# EasyEDA Pro project ProProject_Acho.epro, board PCB10
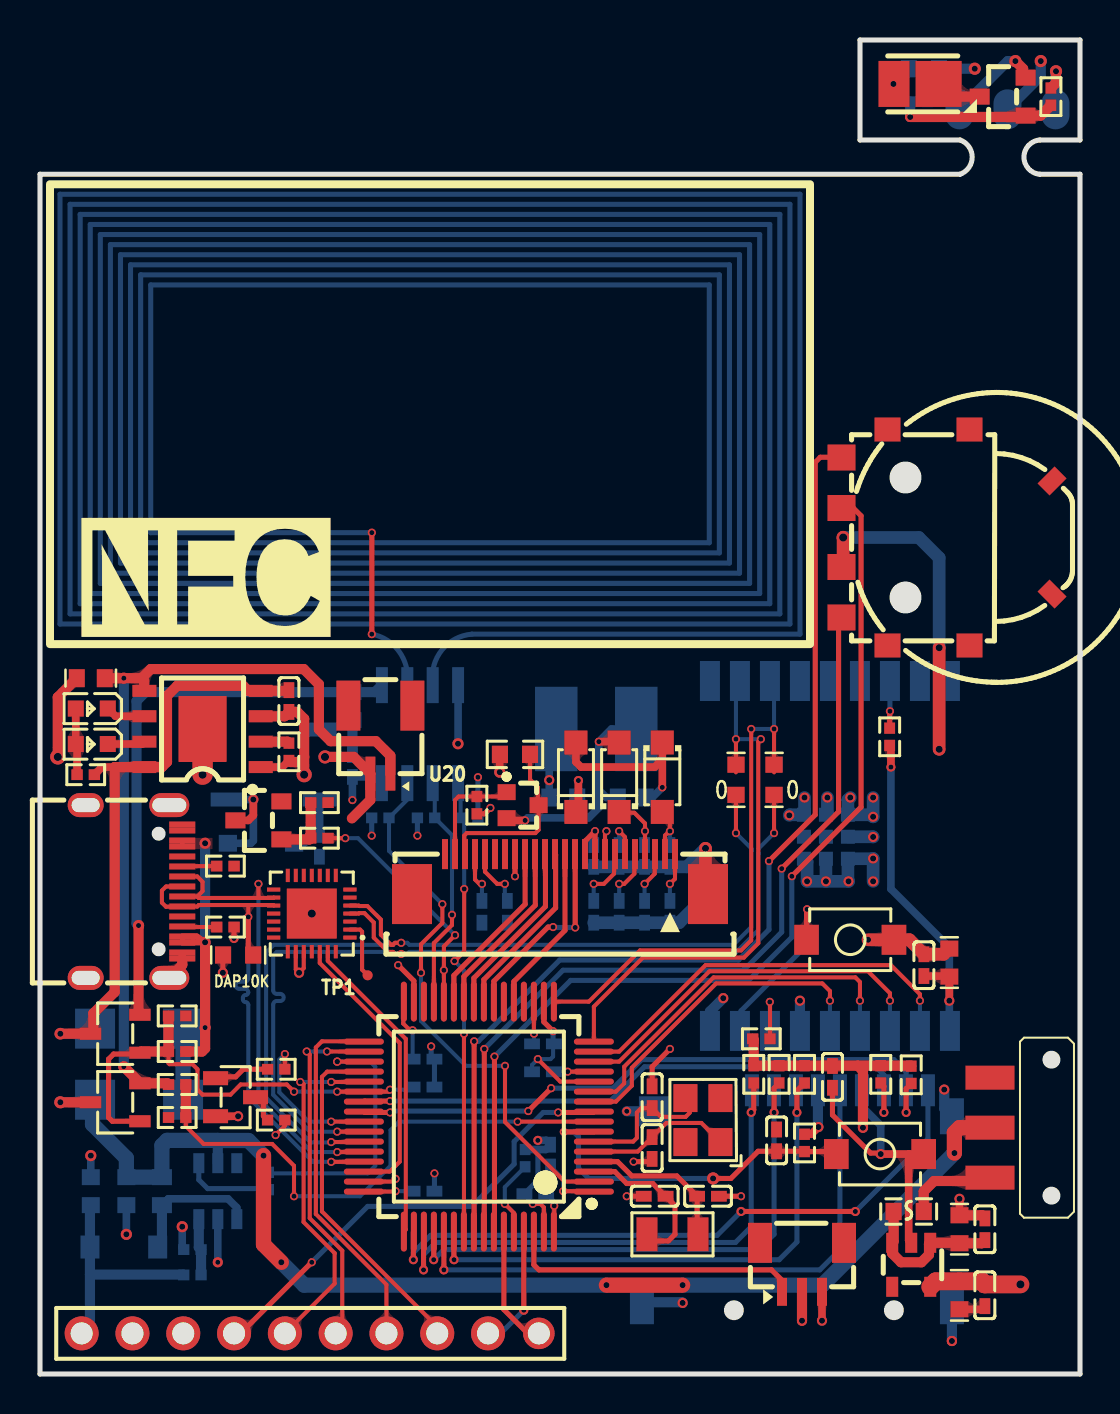
[diagram p0: board, top side]
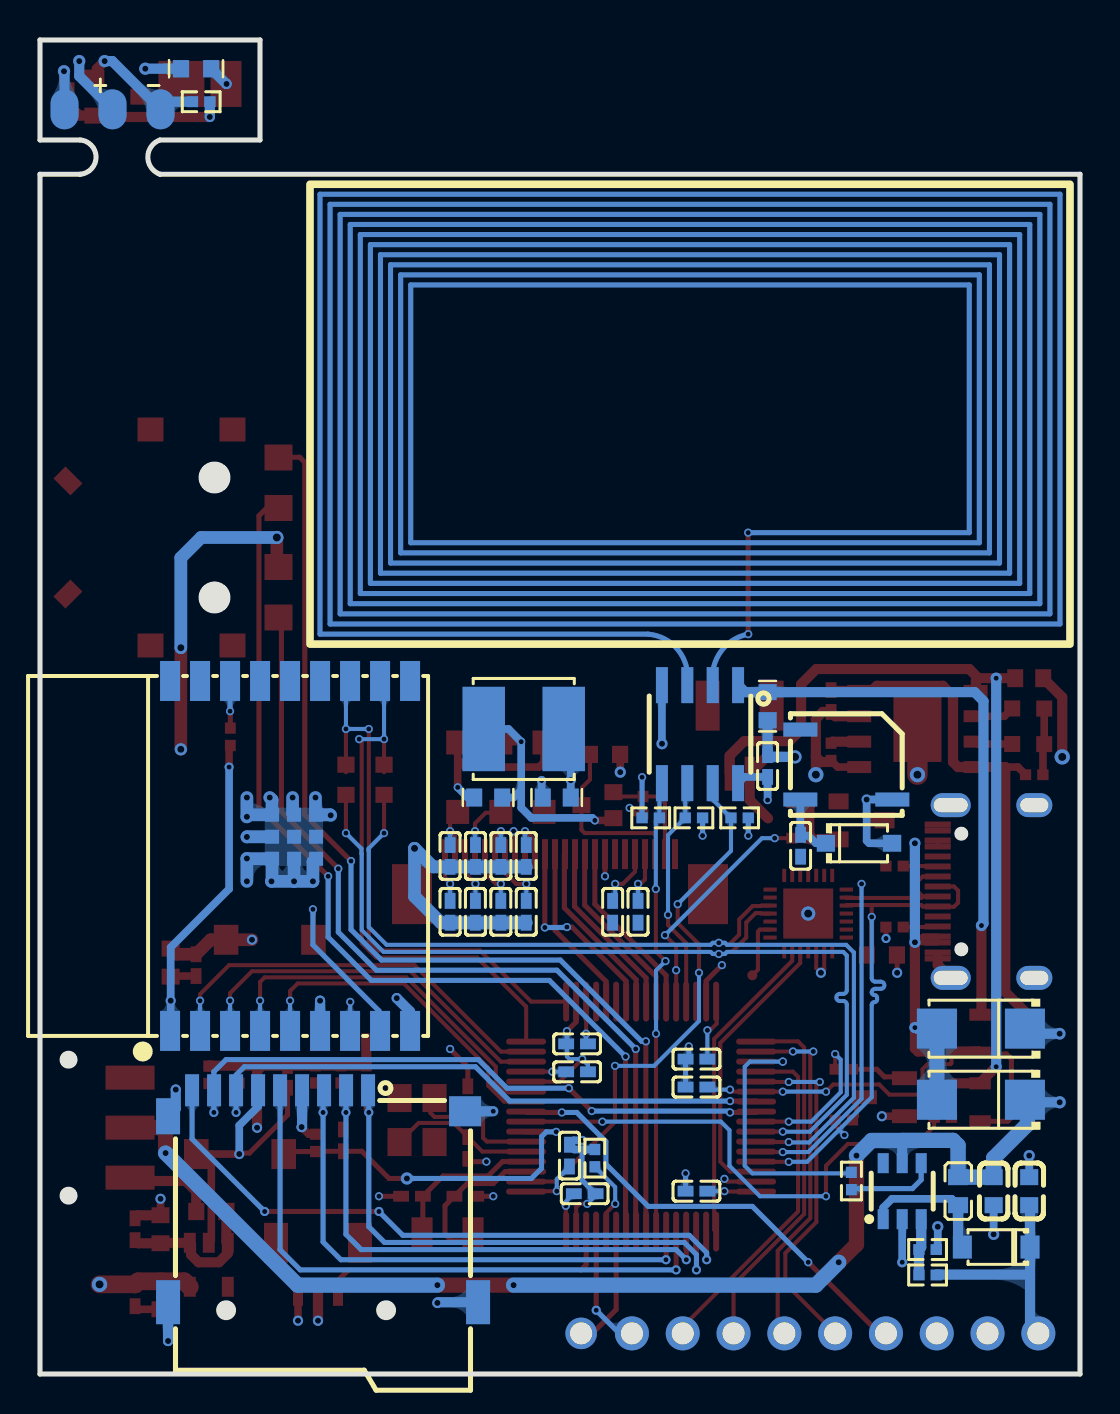
[diagram p1: board, bottom side, seen from below]

Outline 52 x 66.71 mm; copper layers: Top Layer, Inner1, Inner2, Bottom Layer. Coordinates in mm from the lower left corner of the outline.
Outline path: 0,60 0,0 52,0 52,60 50,60 arc(49.2,60.86) 50,61.71 52,61.71 52,66.71 41,66.71 41,61.71 46,61.71 arc(46.61,60.86) 46,60 0,60
Stack: Top Layer 0.035mm 外层铜厚1oz / Dielectric1 0.2104mm 7628 RC49% 8.6mil / Inner1 0.0152mm 内层铜厚 / Dielectric2 1.065mm 1.1mm H/HOZ 含铜 / Inner2 0.0152mm 内层铜厚 / Dielectric3 0.2104mm 7628 RC49% 8.6mil / Bottom Layer 0.035mm 外层铜厚1oz

## Design rules (mm)
net DAP_UART_TX: DP2
net DAP_UART_RX: DP2
net WIFI_UART_TX: DP1
net WIFI_UART_RX: DP1
template: 自定义配置
spacing copperThickness1oz (default): track to track 0.102, other pairs 0.152 to 0.3
spacing copperThickness2oz: track to track 0.203, other pairs 0.152 to 0.3
spacing copperThicknessInner0.5oz: track to track 0.089, other pairs 0.152 to 0.3
track width copperThickness1oz (default): min 0.102, default 0.254, max 2.54
track width copperThickness2oz: min 0.203, default 0.254, max 2.54
track width copperThickness0.5oz: min 0.089, default 0.254, max 2.54
differential pair differentialPair (default): width min 0.127, default 0.254, max 2.54; gap min 0.152, default 0.152
via viaSize (default): diameter min 0.3, default 0.5, max 10; hole min 0.2, default 0.26, max 6.3

## Placement (name value [footprint] x y rotation side)
BUZZER1  4000Hz  [BUZ-SMD_L5.0-W5.5-P4.60]  11.68 30.48 180 bottom
C1  100nF  [C0402]  25.53 10.92 270 bottom
C2  12pF  [C0402]  33.4 8.89 180 top
C3  12pF  [C0402]  30.73 8.89 0 top
C4  10pF  [C0402]  30.61 13.84 90 top
C5  100nF  [C0402]  36.83 11.68 270 top
C6  100nF  [C0402]  15.62 30.41 270 bottom
C7  20pF  [C0402]  30.61 11.3 270 top
C8  10uF  [C0603]  15.62 33.4 90 bottom
C9  100nF  [C0402]  19.18 14.35 180 bottom
C10  100nF  [C0402]  25.15 15.11 0 bottom
C11  100nF  [C0402]  25.15 16.51 180 bottom
C12  100nF  [C0402]  19.18 15.75 180 bottom
C13  100nF  [C0402]  19.18 9.14 180 bottom
C14  100nF  [C0402]  24.76 9.02 0 bottom
C15  1uF  [C0402]  22.1 23.11 90 bottom
C16  1uF  [C0402]  23.37 23.11 90 bottom
C17  100nF  [C0402]  12.45 33.66 90 top
C18  10uF  [C0603]  2.54 34.8 0 top
C19  100nF  [C0402]  39.62 14.86 90 top
C20  4.7uF  [C0603]  26.16 28.83 180 bottom
C21  100nF  [C0402]  27.69 25.91 90 bottom
C22  4.7uF  [C0603]  29.59 28.83 180 bottom
C23  1uF  [C0402]  27.69 23.11 90 bottom
C24  -  [C0402]  28.96 25.91 90 bottom
C25  -  [C0402]  28.96 23.11 90 bottom
C26  10uF  [C0603]  45.97 7.24 270 top
C27  100nF  [C0402]  47.24 7.24 270 top
C28  100nF  [C0402]  47.24 3.94 90 top
C29  10uF  [C0603]  45.97 3.94 90 top
C30  -  [C0402]  30.23 25.91 90 bottom
C31  -  [C0402]  30.23 23.11 90 bottom
C32  -  [C0402]  31.5 25.91 90 bottom
C33  -  [C0402]  31.5 23.11 90 bottom
C34  22uf  [C0603]  4.32 9.14 270 bottom
C35  100nF  [C0402]  44.2 20.45 270 top
C36  22uf  [C0603]  2.54 9.14 270 bottom
C37  10uF  [C0603]  45.47 20.57 270 top
C38  100nF  [C0402]  13.97 26.42 270 bottom
D1  SS34-A  [SMA_L4.3-W2.6-LS5.2-RD]  4.95 17.27 0 bottom
D2  SS34-A  [SMA_L4.3-W2.6-LS5.2-RD]  4.95 13.72 0 bottom
D3  MBR0530  [SOD-123FL_L2.7-W1.8-LS3.7-RD]  26.8 29.84 90 top
D4  MBR0530  [SOD-123FL_L2.7-W1.8-LS3.7-RD]  31.12 29.84 270 top
D5  MBR0530  [SOD-123FL_L2.7-W1.8-LS3.7-RD]  28.96 29.84 90 top
D6  DSS14  [SOD-123_L2.8-W1.8-LS3.7-RD]  4.19 6.35 0 bottom
L1  68uH  [IND-SMD_L5.0-W5.0]  27.81 32.26 180 bottom
L2  4.7uH-INDUCTOR-0603  [IND-SMD_L1.6-W1.0]  6.1 9.14 270 bottom
LED1  2835LEDLM281BA+,3000K,Ra90,S3亮度,VF=2.9-3.0V黄光  [LED-SMD_L3.5-W2.8_28353V60MA6500K]  43.81 64.52 0 top
LED2  -  [LED_0603]  2.54 33.27 180 top
LED3  -  [LED_0603]  2.54 31.5 180 top
Q1  S8550  [SOT-23-3_L2.9-W1.3-P1.90-LS2.4-BR]  9.78 13.84 180 top
Q2  -  [S8050_SOT-23]  48.13 63.75 0 top
Q3  SI1308EDL-T1-GE3  [SOT-323_L2.0-W1.3-P1.30-LS2.1-BR]  24.13 28.45 180 top
Q4  -  [S8050_SOT-23]  10.92 27.56 0 top
R1  10K  [R0402]  24.26 10.79 90 bottom
R2  10K  [R0402]  38.23 11.56 90 top
R3  10K  [R0402]  17.02 27.81 180 bottom
R4  2K  [R0402]  19.3 27.81 180 bottom
R5  2K  [R0402]  21.46 27.81 0 bottom
R6  10K  [R0402]  11.81 15.24 0 top
R7  10K  [R0402]  11.81 12.7 180 top
R8  -  [R0402]  9.27 22.35 0 top
R9  -  [R0402]  9.27 25.4 0 top
R10  2K  [R0402]  50.55 63.88 90 top
R11  10K  [R0603]  9.91 20.95 0 top
R13  10K  [R0402]  2.29 29.97 0 top
R14  0  [R0603]  36.7 29.72 270 top
R15  0  [R0603]  34.8 29.72 270 top
R16  1.2K  [R0402]  12.45 31.11 90 top
R17  3R  [R0603]  23.75 30.99 180 top
R18  10K  [R0402]  43.56 14.96 90 top
R19  10K  [R0402]  42.04 14.99 90 top
R20  10K  [R0402]  38.23 14.99 90 top
R21  10K  [R0402]  36.96 14.99 90 top
R22  10K  [R0402]  35.69 14.99 90 top
R23  10K  [R0402]  21.84 28.45 90 top
R24  -  [R0402]  6.86 16.13 180 top
R25  -  [R0402]  6.86 17.91 180 top
R26  -  [R0402]  6.86 14.48 180 top
R27  -  [R0402]  6.86 12.83 0 top
R28  10K  [R0402]  42.48 31.87 270 top
R29  10K  [R0402]  11.43 9.65 90 bottom
R30  10K  [R0402]  36.07 16.76 180 top
R31  -  [R0402]  7.62 4.95 0 bottom
R32  10K  [R0402]  7.62 6.22 0 bottom
R33  20R  [R0603]  44.2 65.28 0 bottom
R34  5.1K  [R0402]  43.94 63.63 180 bottom
R35  6.5K  [R0402]  13.97 26.8 180 top
R36  2K  [R0402]  13.97 28.58 180 top
SW1  -  [拨动开关封装]  47.5 12.32 270 top
TP1  -  [Test-Point-0.5mm]  16.38 19.94 0 top
U1  STM32F446RET6  [LQFP-64_L10.0-W10.0-P0.50-LS12.0-BL]  21.94 12.87 90 top
U2  二脚小龟直  [KEY-SMD_L3.9-W3.0-LS5.0]  42 11 0 top
U3  13.56MHz  [SO-8_L4.9-W3.9-P1.27-LS6.0-BL]  19 32 0 bottom
U4  CH549F  [QFN-28_L4.0-W4.0-P0.40-BL-EP]  13.59 23.03 90 top
U5  BX-SH1.0-3PLT  [CONN-SMD_3P-P1.00_BX-SH1.0-3PLT]  38.1 5.33 0 top
U6  -  [LED2835驱动板接口封装]  45.97 63.25 0 top
U7  TP4056  [ESOP-8_L4.9-W3.9-P1.27-LS6.0-BL-EP]  8.13 32.26 90 top
U8  PPFPC24/0.5mmSMD下面接触  [FPC-SMD_F0501-T-24-20T-R]  26 25 0 top
U9  SIQ-02FVS3  [SW-SMD_SIQ-02FVS3_1]  45.34 41.83 270 top
U10  自弹TF卡座TFAA  [SIM-SMD_C9900015645]  37.85 8.89 180 bottom
U11  AO3401  [SOT-23-3_L2.9-W1.6-P1.90-LS2.8-BR]  3.76 17.02 0 top
U12  AO3401  [SOT-23-3_L2.9-W1.6-P1.90-LS2.8-BR]  3.76 13.59 0 top
U13  FUSE0603  [F0603]  43.43 8.13 180 top
U14  RT9013-33GB  [SOT-23-5_L2.9-W1.6-P0.95-LS2.8-BR]  43.56 5.46 90 top
U15  -  [Acho音频模块接口封装]  8.31 1.27 0 top
U16  2.4GHz  [BULETM-SMD_ESPRESSIF_ESP32-C3-WROOM-02-N4-4MB]  39.5 25.91 90 bottom
U17  SX1308  [SOT-23-6_L2.9-W1.6-P0.95-LS2.8-BR]  8.89 9.14 270 bottom
U18  二脚小龟直  [KEY-SMD_L3.9-W3.0-LS5.0]  40.51 21.72 180 top
U19  1N4148  [SOD-123_L2.7-W1.7-LS3.8-RD]  11.05 26.54 180 bottom
U20  BX-SH1.0-2PWT  [CONN-SMD_2P-P1.00_BX-SH1.0-2PWT]  17.02 31.72 180 top
USB1  KH-TYPE-C-16P  [USB-C-SMD_KH-TYPE-C-16P]  4.7 24.13 270 top
X1  32.768kHz  [OSC-SMD_L3.2-W1.5]  31.62 6.99 0 top
X2  12MHz  [OSC-SMD_4P-L3.2-W2.5-BL]  33.15 12.7 90 top

## Footprints (pads in the part's own frame, mm; a bottom-side part is the same pattern mirrored in y, then rotated)
Acho音频模块接口封装
  round 1.575 hole 1.1: 1(16.637,0.762)
  round 1.7 hole 1.1: 2(14.097,0.762) 3(11.557,0.762) 4(9.017,0.762) 5(6.477,0.762) 6(3.937,0.762) 7(1.397,0.762) 8(-1.143,0.762) 9(-3.683,0.762) 10(-6.223,0.762)
BULETM-SMD_ESPRESSIF_ESP32-C3-WROOM-02-N4-4MB
  rect 2x1 smd: 1(-8.75,6) 2(-8.75,4.5) 3(-8.75,3) 4(-8.75,1.5) 5(-8.75,0) 6(-8.75,-1.5) 7(-8.75,-3) 8(-8.75,-4.5) 9(-8.75,-6) 10(8.75,-6) 11(8.75,-4.5) 12(8.75,-3) 13(8.75,-1.5) 14(8.75,0) 15(8.75,1.5) 16(8.75,3) 17(8.75,4.5) 18(8.75,6)
  rect 0.7x0.7 smd: 19(-0.14,-1.3) 19(-0.14,-0.2) 19(-0.14,0.9) 19(0.96,-1.3) 19(0.96,-0.2) 19(0.96,0.9) 19(2.06,-1.3) 19(2.06,-0.2) 19(2.06,0.9)
BUZ-SMD_L5.0-W5.5-P4.60
  rect 1.7x0.7 smd: 1(-2.3,-1.75) 2(2.3,-1.75) 3(-2.3,1.75)
C0402
  rect 0.79x0.54 smd: 1(-0.545,0) 2(0.545,0)
C0603
  rect 0.8x0.9 smd: 1(-0.7,0) 2(0.7,0)
CONN-SMD_2P-P1.00_BX-SH1.0-2PWT
  rect 0.5x1.7 smd: 1(-0.5,1.7) 2(0.5,1.7)
  rect 1.2x2.5 smd: 3(1.6,-1.7) 4(-1.6,-1.7)
CONN-SMD_3P-P1.00_BX-SH1.0-3PLT
  rect 0.5x1.4 smd: 1(-1,-1.225) 2(0,-1.225) 3(1,-1.225)
  rect 1.2x2 smd: 4(2.1,1.225) 5(-2.1,1.225)
ESOP-8_L4.9-W3.9-P1.27-LS6.0-BL-EP
  rect 0.6x1.2 smd: 1(-1.905,-2.909) 2(-0.635,-2.909) 3(0.635,-2.909) 4(1.905,-2.909) 5(1.905,2.909) 6(0.635,2.909) 7(-0.635,2.909) 8(-1.905,2.909)
  rect 3.3x2.4 smd: 9(0,0)
F0603
  rect 0.806x0.864 smd: 1(-0.753,0) 2(0.753,0)
FPC-SMD_F0501-T-24-20T-R
  rect 0.3x1.5 smd: 1(5.75,1) 2(5.25,1) 3(4.75,1) 4(4.25,1) 5(3.75,1) 6(3.25,1) 7(2.75,1) 8(2.25,1) 9(1.75,1) 10(1.25,1) 11(0.75,1) 12(0.25,1) 13(-0.25,1) 14(-0.75,1) 15(-1.25,1) 16(-1.75,1) 17(-2.25,1) 18(-2.75,1) 19(-3.25,1) 20(-3.75,1) 21(-4.25,1) 22(-4.75,1) 23(-5.25,1) 24(-5.75,1)
  rect 2x3 smd: 25(-7.4,-1) 26(7.4,-1)
IND-SMD_L1.6-W1.0
  rect 0.8x1 smd: 1(-0.7,0) 2(0.7,0)
IND-SMD_L5.0-W5.0
  rect 2.124x4.22 smd: 1(2,0) 2(-2,0)
KEY-SMD_L3.9-W3.0-LS5.0
  rect 1.23x1.5 smd: 1(-2.185,0) 2(2.185,0)
LED2835驱动板接口封装
  oval 1.4x2 smd far side: 1(4.8,0) 2(2.4,0) 3(0,0)
LED-SMD_L3.5-W2.8_28353V60MA6500K
  rect 1.55x2.3 smd: 1(-1.115,0)
  rect 2.3x2.3 smd: 2(1.115,0)
LED_0603
  rect 0.8x0.8 smd: 1(-0.851,-0.01) 2(0.75,-0.005)
LQFP-64_L10.0-W10.0-P0.50-LS12.0-BL
  oval 0.3x2 smd: 1(-3.75,-5.75) 2(-3.25,-5.75) 3(-2.75,-5.75) 4(-2.25,-5.75) 5(-1.75,-5.75) 6(-1.25,-5.75) 7(-0.75,-5.75) 8(-0.25,-5.75) 9(0.25,-5.75) 10(0.75,-5.75) 11(1.25,-5.75) 12(1.75,-5.75) 13(2.25,-5.75) 14(2.75,-5.75) 15(3.25,-5.75) 16(3.75,-5.75) 33(3.75,5.75) 34(3.25,5.75) 35(2.75,5.75) 36(2.25,5.75) 37(1.75,5.75) 38(1.25,5.75) 39(0.75,5.75) 40(0.25,5.75) 41(-0.25,5.75) 42(-0.75,5.75) 43(-1.25,5.75) 44(-1.75,5.75) 45(-2.25,5.75) 46(-2.75,5.75) 47(-3.25,5.75) 48(-3.75,5.75)
  oval 2x0.3 smd: 17(5.75,-3.75) 18(5.75,-3.25) 19(5.75,-2.75) 20(5.75,-2.25) 21(5.75,-1.75) 22(5.75,-1.25) 23(5.75,-0.75) 24(5.75,-0.25) 25(5.75,0.25) 26(5.75,0.75) 27(5.75,1.25) 28(5.75,1.75) 29(5.75,2.25) 30(5.75,2.75) 31(5.75,3.25) 32(5.75,3.75) 49(-5.75,3.75) 50(-5.75,3.25) 51(-5.75,2.75) 52(-5.75,2.25) 53(-5.75,1.75) 54(-5.75,1.25) 55(-5.75,0.75) 56(-5.75,0.25) 57(-5.75,-0.25) 58(-5.75,-0.75) 59(-5.75,-1.25) 60(-5.75,-1.75) 61(-5.75,-2.25) 62(-5.75,-2.75) 63(-5.75,-3.25) 64(-5.75,-3.75)
OSC-SMD_4P-L3.2-W2.5-BL
  rect 1.4x1.2 smd: 1(-1.1,-0.875) 2(1.1,-0.875) 3(1.1,0.875) 4(-1.1,0.875)
OSC-SMD_L3.2-W1.5
  rect 1.05x1.7 smd: 1(-1.275,0) 2(1.275,0)
QFN-28_L4.0-W4.0-P0.40-BL-EP
  rect 0.2x0.665 smd: 1(-1.2,-1.907) 2(-0.8,-1.907) 3(-0.4,-1.907) 4(0,-1.907) 5(0.4,-1.907) 6(0.8,-1.907) 7(1.2,-1.907) 15(1.2,1.907) 16(0.8,1.907) 17(0.4,1.907) 18(0,1.907) 19(-0.4,1.907) 20(-0.8,1.907) 21(-1.2,1.907)
  rect 0.665x0.2 smd: 8(1.907,-1.2) 9(1.907,-0.8) 10(1.907,-0.4) 11(1.907,0) 12(1.907,0.4) 13(1.907,0.8) 14(1.907,1.2) 22(-1.907,1.2) 23(-1.907,0.8) 24(-1.907,0.4) 25(-1.907,0) 26(-1.907,-0.4) 27(-1.907,-0.8) 28(-1.907,-1.2)
  rect 2.5x2.5 smd: 29(0,0)
R0402
  rect 0.566x0.54 smd: 1(-0.433,0) 2(0.433,0)
R0603
  rect 0.806x0.864 smd: 1(-0.753,0) 2(0.753,0)
S8050_SOT-23
  rect 1x0.8 smd: 1(1.15,-0.823) 2(1.15,1.077) 3(-1.15,0.127)
SIM-SMD_C9900015645
  rect 0.7x1.6 smd: 1(2.25,5.3) 2(1.15,5.3) 3(0.05,5.3) 4(-1.05,5.3) 5(-2.15,5.3) 6(-3.25,5.3) 7(-4.35,5.3) 8(-5.45,5.3) 9(-6.55,5.3)
  rect 1.2x1.8 smd: 10(-7.75,4)
  rect 1.6x1.5 smd: 11(7.1,4.25)
  rect 1.2x2.2 smd: 12(-7.75,-5.3) 13(7.75,-5.3)
SMA_L4.3-W2.6-LS5.2-RD
  rect 2x2 smd: 1(-2.2,0) 2(2.2,0)
SO-8_L4.9-W3.9-P1.27-LS6.0-BL
  rect 0.6x1.8 smd: 1(-1.905,-2.45) 2(-0.635,-2.45) 3(0.635,-2.45) 4(1.905,-2.45) 5(1.905,2.45) 6(0.635,2.45) 7(-0.635,2.45) 8(-1.905,2.45)
SOD-123_L2.7-W1.7-LS3.8-RD
  rect 0.91x0.84 smd: 1(-1.655,0) 2(1.655,0)
SOD-123_L2.8-W1.8-LS3.7-RD
  rect 0.95x1.15 smd: 1(-1.692,0) 2(1.692,0)
SOD-123FL_L2.7-W1.8-LS3.7-RD
  rect 1.2x1.15 smd: 1(-1.735,0) 2(1.735,0)
SOT-23-3_L2.9-W1.3-P1.90-LS2.4-BR
  rect 1.25x0.7 smd: 1(1,-0.95) 2(1,0.95) 3(-1,0)
SOT-23-3_L2.9-W1.6-P1.90-LS2.8-BR
  rect 1.07x0.6 smd: 1(1.235,-0.95) 2(1.235,0.95) 3(-1.235,0)
SOT-23-5_L2.9-W1.6-P0.95-LS2.8-BR
  rect 1x0.6 smd: 1(1.1,-0.95) 2(1.1,0) 3(1.1,0.95) 4(-1.1,0.95) 5(-1.1,-0.95)
SOT-23-6_L2.9-W1.6-P0.95-LS2.8-BR
  rect 1x0.55 smd: 1(1.4,-0.95) 2(1.4,0) 3(1.4,0.95) 4(-1.4,0.95) 5(-1.4,0) 6(-1.4,-0.95)
SOT-323_L2.0-W1.3-P1.30-LS2.1-BR
  rect 0.9x0.8 smd: 1(0.8,-0.65) 2(0.8,0.65) 3(-0.8,0)
SW-SMD_SIQ-02FVS3_1
  rect 1.2x1.3 smd: 1(5.4,-2.964) 2(5.4,1.136) 5(-5.4,1.136) 6(-5.4,-2.964)
  rect 0.85x1.2 smd rot 135: 3(2.829,5.264)
  rect 0.85x1.2 smd rot 45: 4(-2.829,5.264)
  rect 1.3x1.4 smd: A(-4,-5.264) B(4,-5.264) C(1.475,-5.264) S(-1.475,-5.264)
Test-Point-0.5mm
  round 0.5 smd: 1(0,0)
USB-C-SMD_KH-TYPE-C-16P
  oval 1.2x2 hole 0.7x1.7: 1(-4.32,1.765) 2(4.32,1.765)
  oval 1.2x1.8 hole 0.7x1.4: 3(-4.32,-2.415) 4(4.32,-2.415)
  rect 0.3x1.3 smd: A1(-3.35,2.415) A4(-2.55,2.415) A5(-1.25,2.415) A6(-0.25,2.415) A7(0.25,2.415) A8(1.25,2.415) A9(2.55,2.415) A12(3.35,2.415) B1(3.05,2.415) B4(2.25,2.415) B5(1.75,2.415) B6(0.75,2.415) B7(-0.75,2.415) B8(-1.75,2.415) B9(-2.25,2.415) B12(-3.05,2.415)
拨动开关封装
  rect 1.2x2.45 smd: 1(-2.5,0) 2(0,0) 3(2.5,0)

## Nets
+3.3V: C1.2 C6.2 C10.2 C11.2 C12.2 C13.2 C14.2 C19.2 C20.2 C21.2 C28.2 C29.2 C35.2 C37.2 L1.1 Q1.2 R2.2 R3.2 R4.2 R5.2 R11.1 R18.2 R19.2 R20.2 R21.2 R22.2 R28.2 R30.2 U1.1 U1.13 U1.19 U1.32 U1.48 U1.64 U3.8 U4.23 U4.24 U5.2 U8.9 U8.10 U10.4 U14.5 U15.9 U16.1
GND: C1.1 C2.1 C3.1 C4.2 C5.1 C6.1 C7.2 C8.1 C9.1 C10.1 C11.1 C12.1 C13.1 C14.1 C15.1 C16.1 C17.1 C18.1 C19.1 C20.1 C21.1 C23.1 C24.1 C25.1 C26.1 C27.1 C28.1 C29.1 C30.1 C31.1 C32.1 C33.1 C34.2 C35.1 C36.1 C37.1 C38.2 D3.1 Q4.2 R1.2 R8.2 R9.2 R16.1 R17.2 R23.1 R25.1 R27.1 R32.1 R36.1 U1.12 U1.18 U1.31 U1.47 U1.63 U2.2 U3.4 U4.29 U5.3 U7.1 U7.3 U7.9 U8.8 U8.17 U8.25 U8.26 U9.C U10.6 U10.10 U10.11 U10.12 U10.13 U14.2 U15.8 U16.6 U16.9 U16.19 U17.2 U18.1 U20.2 USB1.1 USB1.2 USB1.3 USB1.4 USB1.A1 USB1.A12 USB1.B1 USB1.B12
VBAT: C18.2 R26.2 U7.5 U12.2 U20.1
VBUS: D1.2 D2.2 R24.1 USB1.A4 USB1.A9 USB1.B4 USB1.B9
VCC: C34.1 D2.1 L2.1 SW1.2 U12.3 U17.5
VDD: C36.2 D6.1 R31.1 U15.10
BAT_VOTAGE_ADC: R26.1 R27.2 U1.8
BEEP: R35.1 U1.28
DAP_SWCLK: U1.49 U4.27
DAP_SWDIO: U1.46 U4.26
DAP_UART_RX: R14.2 U1.42 U4.4
DAP_UART_TX: R15.2 U1.43 U4.5
ENCODER_ENTER: U1.58 U9.S
ENCODER_TIM3_CH1: U1.56 U9.A
ENCODER_TIM3_CH2: U1.57 U9.B
EPD_BUSY: U1.27 U8.16
EPD_CS: U1.24 U8.13
EPD_D/C: U1.25 U8.14
EPD_RST: U1.26 U8.15
EPD_SPI_CLK: U1.21 U8.12
EPD_SPI_MOSI: U1.23 U8.11
GDR: Q3.1 R23.2 U8.23
LED: U1.62 U5.1
LED_VCC: R33.2 U6.2
NRST: C5.2 R2.1 U1.7 U2.1
OSC32_IN: C3.2 U1.3 X1.1
OSC32_OUT: C2.2 U1.4 X1.2
OSC_IN: C7.1 U1.5 X2.1
OSC_OUT: C4.1 U1.6 X2.3
PREVGH: C30.2 D5.1 U8.4
PREVGL: C32.2 D4.2 U8.2
READY: U1.14 U16.3
RESE: Q3.3 R17.1 U8.22
RX_HOLD: U1.11 U16.4
SDIO_CLK: U1.53 U10.5
SDIO_CMD: R20.1 U1.54 U10.3
SDIO_D0: R19.1 U1.39 U10.7
SDIO_D1: R18.1 U1.40 U10.8
SDIO_D2: R22.1 U1.51 U10.1
SDIO_D3: R21.1 U1.52 U10.2
SDIO_DETECT: U1.50 U10.9
SPK_EN: R29.2 U1.35
ST25_ANT: U3.2 U3.3
ST25_GPO: R3.1 U1.2 U3.7
ST25_I2C_SCL: R4.1 U1.29 U3.6
ST25_I2C_SDA: R5.1 U1.55 U3.5
ST25_VEH: C8.2 U3.1 U11.2
TX_HOLD: U1.10 U16.5
USB_DETECT: C9.2 R24.2 R25.2 U1.38 U11.1 U12.1
USB_ENABLE: R6.2 U1.41
USB_N: U1.44 U4.16 USB1.A7 USB1.B7
USB_P: R7.1 R11.2 U1.45 U4.17 USB1.A6 USB1.B6
V_CHARGE: C17.2 D1.1 R13.2 U7.4 U7.8 U11.3
WIFI_EN: U1.15 U16.2
WIFI_UART_RX: R15.1 U1.16 U16.11
WIFI_UART_TX: R14.1 U1.17 U16.12
WM8960_HP_ADC: U1.9 U15.7
WM8960_I2C_SCL: U1.61 U15.2
WM8960_I2C_SDA: U1.59 U15.1
WM8960_I2S_BCLK: U1.34 U15.5
WM8960_I2S_DAT: U1.36 U15.3
WM8960_I2S_LRCLK: U1.33 U15.4
WM8960_I2S_MCLK: U1.37 U15.6
$1N193: D6.2 L2.2 U17.1
$1N224: R31.2 R32.2 U17.3
$1N908: R29.1 U17.4
$1N11137: R16.2 U7.2
$1N11353: LED3.1 U7.7
$1N11426: LED2.1 U7.6
$1N11430: LED2.2 LED3.2 R13.1
$1N17856: C26.2 C27.2 U13.2 U14.1 U14.3
$1N17857: SW1.3 U13.1
$1N20354: TP1.1 U4.2
$1N20560: R8.1 USB1.B5
$1N20561: R9.1 USB1.A5
$1N24105: U16.8 U18.2
$1N24200: R30.1 U16.7
$1N24263: R28.1 U16.16
$1N25076: C22.1 D3.2 D4.1
$1N25092: C22.2 D5.2 L1.2 Q3.2
$1N25624: C15.2 U8.21
$1N25630: C16.2 U8.20
$1N25688: C23.2 U8.7
$1N25691: C24.2 U8.6
$1N25694: C25.2 U8.5
$1N25702: C31.2 U8.3
$1N25710: C33.2 U8.1
$1N27235: R1.1 U1.60
$1N38507: Q1.1 R6.1
$1N38509: Q1.3 R7.2
$1N62037: Q2.1 R10.1 R34.2
$1N62044: Q2.2 R34.1 U6.3
$1N62069: R10.2 U6.1
$1N70319: LED1.2 Q2.3
$1N72407: LED1.1 R33.1
$1N74846: BUZZER1.2 Q4.3 U19.2
$1N74877: BUZZER1.1 C38.1 U19.1
$1N74960: Q4.1 R35.2 R36.2

Pads without a net: BUZZER1 3; SW1 1; U1 20 22 30; U4 1 3 6 7 8 9 10 11 12 13 14 15 18 19 20 21 22 25 28; U5 4 5; U8 18 19 24; U9 1 2 3 4 5 6; U14 4; U16 10 13 14 15 17 18; U17 6; U20 3 4; USB1 A8 B8; X2 2 4

## Via types
v1: diameter 0.406, hole 0.254, Top Layer to Bottom Layer, 100 vias
v2: diameter 0.508, hole 0.305, Top Layer to Bottom Layer, 32 vias
v3: diameter 0.559, hole 0.305, Top Layer to Bottom Layer, 7 vias
v4: diameter 0.711, hole 0.406, Top Layer to Bottom Layer, 1 via
v5: diameter 0.508, hole 0.254, Top Layer to Bottom Layer, 1 via
v6: diameter 0.66, hole 0.406, Top Layer to Bottom Layer, 2 vias
v7: diameter 0.457, hole 0.254, Top Layer to Bottom Layer, 18 vias
v8: diameter 0.61, hole 0.355, Top Layer to Bottom Layer, 3 vias
v9: diameter 0.762, hole 0.406, Top Layer to Bottom Layer, 4 vias
v10: diameter 0.559, hole 0.254, Top Layer to Bottom Layer, 4 vias
v11: diameter 0.584, hole 0.305, Top Layer to Bottom Layer, 1 via
v12: diameter 0.61, hole 0.305, Top Layer to Bottom Layer, 11 vias

## Routing (per net, layer and track width the routed paths; a pad name or vN(x,y) marks a point on that pad's centre or on a via; arc(x,y) is an arc through that point)
+3.3V: length 271.4
  Top Layer w0.203: U1.1 27.67,9.14 v1(26.16,9.14) ; U4.23 12.79,20.23 v2(12.95,20.07) 13.19,20.3 U4.24 ; v1(17.78,9.14) 17.76,9.12 U1.48 ; v1(18.63,17.19) 18.5,17.19 18.16,17.53 18.16,18.59 U1.32 ; v1(25.71,8.41) 25.71,7.14 U1.64 ; U1.19 24.69,17.03 v1(24.7,17.02) ; U1.13 27.69,15.12 v1(26.38,15.12) ; 27.75,27.2 v1(27.75,27.15)
  Top Layer w0.254: U8.9 v1(27.75,27.15) 27.25,26.65 U8.10 ; v2(9.14,20.07) 9.14,20.95 R11.1
  Top Layer w0.381: v2(45.47,18.67) C37.2 45.44,19.9 C35.2 ; R2.2 38.56,11.99 v2(38.92,12.35) ; R28.2 42.54,31.37 v7(42.54,30.35) ; Q1.2 v2(9.91,12.89)
  Top Layer w0.508: R18.2 43.54,15.42 R19.2 R20.2 R21.2 R22.2 35.69,16.71 R30.2 ; 40.89,15.42 41.15,15.16 v2(41.15,12.32) ; v2(38.1,2.67) U5.2
  Top Layer w0.889: v9(49.02,4.48) C28.2 47.09,4.64 C29.2 44.79,4.64 44.51,4.36
  Inner1 w0.381: 29.15,12.35 29.15,12.13 v1(26.16,9.14) ; 29.15,12.35 v2(38.92,12.35) ; 29.15,12.35 v1(26.38,15.12) 24.7,16.8 v1(24.7,17.02) 24.07,17.65 19.09,17.65 v1(18.63,17.19) ; v2(25.46,29.7) 25.91,29.25 25.91,27.18 ; 24.51,19.43 24.51,21.34 ; 24.51,21.34 24.51,25.78 25.91,27.18 ; 24.51,21.34 23.05,21.34 18.92,25.47 18.92,26.92 ; v1(26.16,9.14) v1(17.78,9.14) ; v1(26.16,9.14) 25.71,8.69 v1(25.71,8.41) ; v1(27.75,27.15) 27.72,27.18 25.91,27.18 ; v1(15.62,28.7) 15.62,27.43 16.13,26.92 v1(16.59,26.92) v1(18.87,26.92) 18.92,26.92 ; 18.92,26.92 18.97,26.92 v1(21.9,29.84)
  Inner1 w0.508: 45.47,14.99 28.96,14.99 24.51,19.43 13.59,19.43 v2(12.95,20.07) v2(9.14,20.07) 9.91,19.3 v2(9.91,12.89) ; 45.47,14.99 48.1,12.35 ; 45.47,14.99 v2(45.47,18.67) ; 48.1,12.35 49.02,11.43 v9(49.02,4.48) 48.99,4.48 ; 48.1,12.35 v2(38.92,12.35) ; 48.99,4.48 48.99,6.35 5.59,6.35 4.95,5.72 4.95,2.03 ; 48.99,4.48 39.91,4.48 v2(38.1,2.67)
  Bottom Layer w0.203: v1(24.7,17.02) 24.7,16.61 C11.2 ; C12.2 18.63,17.19 v1(18.63,17.19) ; v1(25.71,8.41) 25.71,8.62 C14.2 ; C13.2 v1(17.78,9.14) ; v1(26.16,9.14) 26.16,9.74 C1.2 ; 25.69,15.11 25.7,15.12 v1(26.38,15.12) ; 27.75,27.2 27.75,26.52 C21.2
  Bottom Layer w0.254: R5.2 v1(21.9,29.84) ; R4.2 v1(18.87,26.92) ; R3.2 v1(16.59,26.92)
  Bottom Layer w0.381: U16.1 45.47,17.19 v2(45.47,18.67) 45.47,21.34 42.54,24.26 v7(42.54,30.35) ; L1.1 25.46,31.91 v2(25.46,29.7) C20.2 ; U3.8 16.78,29.86 C6.2 v1(15.62,28.7)
  Bottom Layer w0.508: v2(38.92,12.35) 38.9,12.37 U10.4 ; 45.47,17.13 U16.1
GND: length 149.4
  Top Layer w0.203: v1(17.78,9.76) 17.64,9.62 U1.47 ; v1(24.89,15.75) 26.02,14.62 U1.12 ; U1.63 25.19,8.33 25.02,8.51 v1(24.64,8.51) ; 28.32,27.18 28.25,27.11 U8.8
  Top Layer w0.254: 21.97,28.02 22.22,28.02 v1(22.52,28.31) ; v2(42.04,11) 41.99,11.05 41.53,11.05 39.62,12.95 C19.1 ; v1(29.68,10.62) 30.47,10.62 C7.2 ; C2.1 v1(35.05,8.89) ; C4.2 30.61,15.37 v1(31.5,16.26) ; v1(17.91,20.45) 18.69,19.66 U1.31 ; U1.18 25.19,17.61 v1(25.65,17.14) ; v1(29.34,8.89) 30.19,8.89 ; v1(19.72,10.03) 19.69,10.03 ; USB1.B1 USB1.A12 ; v7(9.7,21.78) 9.7,22.35 R8.2 ; U8.17 v1(23.75,24.89)
  Top Layer w0.381: C28.1 47.09,3.24 45.97,3.24 ; v7(26.92,29.68) 26.92,28.23 D3.1 ; R16.1 12.12,30.35 U7.1 ; U5.3 v2(39.1,2.67) ; 43.43,11 43.43,11 43.43,6.69 U14.2 ; 43.43,11 v2(42.04,11) ; 43.43,11 U2.2 ; v2(45.97,8.76) C26.1 ; R17.2 22.99,30.98 v3(22.99,30.1)
  Top Layer w0.508: USB1.A12 7.11,20.46 USB1.2 ; C26.1 47.09,7.94 C27.1 ; 13.21,30.86 13.21,32.77 12.86,33.11 C17.1 12.23,32.89 U7.3 ; 13.21,30.86 12.95,30.61 12.52,30.61 R16.1 ; 13.21,30.86 v9(13.21,29.97) ; C18.1 0.89,33.85 v9(0.89,30.86) ; v2(45.6,1.65) 45.59,1.65 ; 15.6,27.79 16.52,28.71 U20.2 15.68,30.86 v6(14.25,30.86)
  Top Layer w0.635: v6(40.16,41.83) 40.16,40.44 U9.C ; C37.1 45.18,20.99 C35.1 43.47,21.72 U18.1 v2(41.4,21.72) ; v8(44.96,31.24) v8(44.96,36.32) ; v8(33.27,26.29) 33.27,24.13 U8.26
  Top Layer w1.016: v9(8.13,29.97) U7.9
  Bottom Layer w0.203: 25.69,16.51 25.65,16.47 25.65,15.88 25.53,15.75 v1(24.89,15.75) 24.6,15.46 C10.1 ; v1(24.64,8.51) 24.22,8.93 C14.1
  Bottom Layer w0.254: v1(25.65,17.14) 25.65,16.55 25.69,16.51 ; 24.9,11.23 24.9,9.69 C14.1 ; C9.1 C12.1 19.56,15.91 v1(19.56,16.38) ; C13.1 v1(19.72,10.03)
  Bottom Layer w0.381: v2(42.04,11) 42.04,12.43 41.1,13.37 U10.6 ; v7(26.92,29.68) 26.92,28.89 C20.1 ; R1.2 25.29,11.23 25.53,11.47 25.31,11.68 v7(24.89,11.68) ; v3(20.9,31.52) 20.91,31.53 U3.4 ; U17.2 v5(8.89,5.59) ; C36.1 v3(2.54,10.92) ; C34.2 v3(4.32,6.99) ; v3(7.11,7.37) 7.11,6.3 R32.1
  Bottom Layer w0.508: U10.12 v2(45.6,1.65) ; v2(45.21,14.22) 45.21,13.27 U10.10 ; U16.6 v2(38,18.67) ; U16.9 33.5,18.13 v2(34.16,18.8) ; U10.13 32.1,3.59 v2(32.13,3.56) ; v6(14.25,30.86) 15.53,30.86 C6.1 C8.1 ; U10.11 v7(29.34,13.14)
  Bottom Layer w0.635: v2(40.51,28.83) 40.4,28.71 40.4,27.97 41.55,27.97 v2(41.66,27.87) v2(41.66,28.83) ; C23.1 C25.1 C31.1 C33.1 31.96,22.57 33.27,23.89 v8(33.27,26.29) 32.35,25.36 C32.1 C30.1 C24.1 C21.1 ; v2(39.3,24.64) v2(40.43,24.64) 40.4,24.67 40.4,25.77 41.64,25.77 v2(41.66,25.78) v2(41.66,24.64) ; v2(39.3,24.64) v2(38.35,24.64) 38.35,25.61 U16.19 ; v2(39.3,24.64) 39.3,25.77 ; v2(37.47,27.94) 37.49,27.97 U16.19 38.23,28 v2(38.23,28.83) ; 40.4,26.87 41.65,26.87 v2(41.66,26.86) ; v8(44.96,36.32) 44.96,40.82 43.94,41.83 v6(40.16,41.83) ; v2(39.37,28.83) 39.37,28.04 39.3,27.97
  vias: v1(28.32,27.15) v4(13.59,23.03)
VBAT: length 41.2
  Top Layer w0.508: 5.08,34.8 5.54,35.25 13.18,35.25 13.94,34.49 13.94,32.23 14.53,31.65 16.79,31.65 17.52,30.92 U20.1 ; 5.08,34.8 v10(4.19,34.8) C18.2 ; 5.08,34.8 5.21,34.67 5.21,34.18 U7.5 ; R26.2 6.36,14.54 U12.2 5,14.56 v10(4.19,15.37)
  Bottom Layer w0.508: v10(4.19,34.8) v10(4.19,15.37)
VBUS: length 19.1
  Top Layer w0.254: USB1.B4 USB1.A9 ; USB1.A4 USB1.B9
  Top Layer w0.305: USB1.B4 7.84,21.88 v3(8.25,21.59) ; USB1.A9 v3(8.25,21.59) ; v3(8.25,21.59) 8.13,21.59
  Top Layer w0.508: v3(8.25,21.59) v10(8.25,17.32) 8.25,16.28 8.1,16.13 R24.1
  Bottom Layer w0.508: v3(8.25,26.54) v3(8.25,21.59) ; v10(8.25,17.32) 8.18,17.32 8.13,17.27 D1.2
  Bottom Layer w0.762: D2.2 D1.2
VCC: length 63
  Top Layer w0.508: v12(1.02,13.59) U12.3
  Top Layer w0.762: v12(32.13,4.44) v12(28.32,4.44) ; v12(11.18,10.92) 11.18,6.48 v12(12.06,5.59) ; SW1.2 45.97,12.32 45.72,12.06 v12(45.72,11.05)
  Bottom Layer w0.508: 2.63,13.59 v12(1.02,13.59) ; U17.5 8.89,11.68
  Bottom Layer w0.635: 8.89,11.68 8.88,11.68
  Bottom Layer w0.762: v12(32.13,4.44) 39.12,4.44 v12(45.72,11.05) ; v12(11.18,10.92) 10.42,11.68 8.89,11.68 ; 2.63,13.59 2.63,12.49 4.32,10.79 C34.1 L2.1 6.1,11.43 6.35,11.68 8.88,11.68 ; v12(28.32,4.44) 13.21,4.44 v12(12.06,5.59)
VDD: length 11.3
  Bottom Layer w0.508: 2.5,4.97 7.17,4.97 R31.1 ; 2.5,4.97 2.5,2.45 U15.10 ; 2.5,4.97 D6.1 2.5,8.4 C36.2
BAT_VOTAGE_ADC: length 27.4
  Top Layer w0.203: v1(23.88,12.62) 27.69,12.62 U1.8 ; R27.2 7.29,12.39 8.18,11.51 11.61,11.51 12.7,10.41 v1(12.7,8.89)
  Top Layer w0.508: R26.1 R27.2
  Bottom Layer w0.203: v1(12.7,8.89) 16,8.89 17.53,10.41 17.53,12.19 17.95,12.62 v1(23.88,12.62)
BEEP: length 11.9
  Top Layer w0.203: v1(15.27,26.8) R35.1 ; U1.28 v1(20.19,20.19) 20.19,21.39 v1(20.75,21.95)
  Bottom Layer w0.203: v1(15.27,26.8) 15.9,26.8 v1(20.75,21.95)
DAP_SWCLK: length 15.7
  Top Layer w0.203: U4.27 14.39,20.66 18.29,16.76 18.29,7.22 U1.49
DAP_SWDIO: length 14.2
  Top Layer w0.203: U1.46 17.49,10.12 17.99,10.62 17.99,16.56 13.99,20.56 U4.26
DAP_UART_RX: length 48.4
  Top Layer w0.203: U1.42 16.19,12.12 v1(14.86,12.12) ; 36.7,28.58 v1(36.7,27.05) ; v1(18.06,21.01) 17.75,21.01 17.65,21.11 17.4,21.11 16.69,21.82 16.69,22.58 16.22,23.05 15.95,23.05 15.93,23.03 U4.4
  Bottom Layer w0.203: v1(36.7,27.05) 35.93,26.28 35.93,26.03 35.91,26.01 35.91,22.2 34.82,21.11 18.47,21.11 18.36,21.01 v1(18.06,21.01) 17.75,21.01 17.65,21.11 11.84,21.11 11.66,20.93 11.66,19.19 arc(11.71,19.06) 11.84,19.01 12.01,19.01 arc(12.19,18.83) 12.01,18.65 11.84,18.65 arc(11.71,18.6) 11.66,18.48 11.66,13.96 13.51,12.12 14.76,12.12
DAP_UART_TX: length 48.4
  Top Layer w0.203: 34.8,28.58 v1(34.8,27.05) ; v1(18.06,21.56) 17.75,21.56 17.65,21.46 17.55,21.46 17.04,21.97 17.04,22.73 16.37,23.4 15.95,23.4 15.93,23.43 U4.5 ; U1.43 16.17,11.6 14.59,11.6
  Bottom Layer w0.203: v1(34.8,27.05) 35.57,26.28 35.57,26.17 35.56,26.16 35.56,22.35 34.67,21.46 18.47,21.46 18.36,21.56 v1(18.06,21.56) 17.75,21.56 17.65,21.46 11.69,21.46 11.31,21.08 11.3,21.08 11.3,13.82 13.54,11.58 14.54,11.58 v1(14.56,11.6)
ENCODER_ENTER: length 49.8
  Top Layer w0.254: v1(22.72,15.88) 22.72,7.15 U1.58 ; U9.S 40.66,43.31 41.05,42.92 41.05,28.35 v1(37.59,24.89)
  Bottom Layer w0.254: v1(37.59,24.89) 37.59,21.84 35.43,19.69 26.53,19.69 v1(22.72,15.88)
ENCODER_TIM3_CH1: length 52.3
  Top Layer w0.254: U9.A 40.06,45.85 39.01,45.85 38.76,45.59 38.76,27.97 v1(36.45,25.65) ; v1(21.71,16.64) 21.71,7.14 U1.56
  Bottom Layer w0.254: v1(21.71,16.64) 21.92,16.64 25.98,20.7 34.93,20.7 36.45,22.22 v1(36.45,25.65)
ENCODER_TIM3_CH2: length 43.4
  Top Layer w0.254: U1.57 22.22,7.14 v1(22.22,16.26) ; U9.B 39.93,37.69 39.93,28.12 v1(37.08,25.27)
  Bottom Layer w0.254: v1(37.08,25.27) 37.08,22.1 35.18,20.19 26.15,20.19 v1(22.22,16.26)
EPD_BUSY: length 8.9
  Top Layer w0.254: U1.27 20.69,19.93 24.26,23.5 24.26,25.99 U8.16
EPD_CS: length 8.9
  Top Layer w0.254: U8.13 25.78,25.97 25.78,23.31 22.19,19.72 U1.24
EPD_D/C: length 8.9
  Top Layer w0.254: U8.14 25.27,25.98 25.27,23.38 21.69,19.8 U1.25
EPD_RST: length 8.9
  Top Layer w0.254: U1.26 21.19,19.87 24.76,23.44 24.76,25.98 U8.15
EPD_SPI_CLK: length 8.4
  Top Layer w0.254: U1.21 23.69,19.63 26.25,22.19 U8.12
EPD_SPI_MOSI: length 9.9
  Top Layer w0.254: U8.11 26.76,25.99 v1(26.76,22.33) ; v1(25.65,22.35) 25.4,22.35 22.69,19.65 U1.23
  Bottom Layer w0.254: v1(25.65,22.35) 25.68,22.33 v1(26.76,22.33)
GDR: length 5.4
  Top Layer w0.203: U8.23 20.75,28.7 20.93,28.88 23.11,28.88 Q3.1
LED: length 15.2
  Top Layer w0.254: 37.1,3.85 37.1,4.68 36.58,5.21 24.95,5.21 24.69,5.46 U1.62
LED_VCC: length 4.9
  Bottom Layer w0.508: U6.2 50.04,64.91 v12(50.04,65.66) ; R33.2 v12(46.74,65.28)
NRST: length 17.6
  Top Layer w0.254: v12(33.66,9.78) 34.54,9.78 35.9,11.14 C5.2 38.21,11.14 R2.1 39.69,11.12 U2.1 ; U1.7 27.68,12.11 v1(26.19,12.11)
  Bottom Layer w0.254: v12(33.66,9.78) 27.43,9.78 26.92,10.29 26.92,11.87 26.68,12.11 v1(26.19,12.11)
OSC32_IN: length 7.9
  Top Layer w0.254: U1.3 28.74,10.12 29.34,9.53 30.64,9.53 C3.2 31.75,8.42 31.75,6.99 31.42,6.66 30.68,6.66 X1.1
OSC32_OUT: length 7.8
  Top Layer w0.254: U1.4 28.87,10.62 29.59,9.91 31.84,9.91 C2.2 32.86,7.03 X1.2
OSC_IN: length 7.3
  Top Layer w0.203: X2.1 33.07,12.55 31.31,12.55 C7.1 29.88,11.12 U1.5
OSC_OUT: length 7.3
  Top Layer w0.203: U1.6 29.66,11.62 29.84,11.81 29.84,13.08 30.06,13.3 C4.1 31.05,12.86 32.28,12.86 32.48,13.06 32.48,13.59 X2.3
PREVGH: length 3.8
  Top Layer w0.203: D5.1 29,28.07 29.72,28.07 30.25,27.53 U8.4
  Bottom Layer w0.203: 30.25,27.18 30.25,26.48 C30.2
  vias: v1(30.25,27.15)
PREVGL: length 3.1
  Top Layer w0.203: D4.2 31.5,27.73 31.5,27.18 31.25,26.93 U8.2
  Bottom Layer w0.203: C32.2 31.5,27.18
  vias: v1(31.5,27.15)
READY: length 19
  Top Layer w0.203: v1(42.5,18.67) 42.5,19.05 41.4,20.14 33.48,20.14 28.96,15.62 U1.14
  Bottom Layer w0.203: U16.3 v1(42.5,18.67)
RESE: length 8.7
  Top Layer w0.203: U8.22 21.21,26.04 21.21,26.92 21.34,27.05 24.76,27.05 24.93,27.22 Q3.3 24.89,28.49 24.89,29.34 24.5,29.73 R17.1
RX_HOLD: length 18.7
  Top Layer w0.203: U1.11 28.8,14.12 29.21,14.54 29.21,15.37 33.68,19.84 40.77,19.84 41,19.61 v1(41,18.67)
  Bottom Layer w0.203: U16.4 v1(41,18.67)
SDIO_CLK: length 30.1
  Top Layer w0.254: 20.19,5.21 U1.53
  Bottom Layer w0.254: v7(20.19,5.21) 38.99,5.21 40,6.21 U10.5
SDIO_CMD: length 28.2
  Top Layer w0.254: R20.1 37.85,14.17 v7(37.85,13.08) ; v7(20.7,5.72) 20.69,5.72 U1.54
  Bottom Layer w0.254: U10.3 37.85,14.14 v7(37.85,13.08) 37.85,6.6 36.96,5.72 v7(20.7,5.72)
SDIO_D0: length 30.3
  Top Layer w0.254: R19.1 42.2,14.39 v7(42.2,13.08) ; 17.52,13.65 16.22,13.65 U1.39
  Bottom Layer w0.254: v7(42.2,13.08) U10.7 42.2,14.95 41.78,15.37 30.23,15.37 28.51,13.65 17.52,13.65
  vias: v1(17.5,13.65)
SDIO_D1: length 32.1
  Top Layer w0.254: U1.40 16.24,13.08 v1(17.5,13.08) ; R18.1 43.31,14.28 v7(43.31,13.08) ; v1(25.56,14.29) v1(24.41,13.15)
  Bottom Layer w0.254: 43.31,14.2 U10.8 ; 43.31,14.2 43.31,15.11 42.7,15.72 30.08,15.72 28.65,14.29 v1(25.56,14.29) ; 43.31,14.2 v7(43.31,13.08) ; v1(17.5,13.08) 17.57,13.15 v1(24.41,13.15)
SDIO_D2: length 28
  Top Layer w0.254: v7(19.18,5.21) 19.18,7.11 U1.51 ; R22.1 35.69,13.21 v7(35.56,13.08)
  Bottom Layer w0.254: v7(19.18,5.21) 19.18,5.97 19.79,6.58 34.77,6.58 35.56,7.37 v7(35.56,13.08) 35.56,14.15 U10.1
SDIO_D3: length 27.7
  Top Layer w0.254: v7(36.7,13.08) 36.7,14.3 R21.1 ; U1.52 19.69,7.11 v7(19.69,5.72)
  Bottom Layer w0.254: U10.2 36.7,14.18 v7(36.7,13.08) 36.7,6.99 35.94,6.22 20.19,6.22 v7(19.69,5.72)
SDIO_DETECT: length 32.3
  Top Layer w0.254: v7(35.05,8.13) v7(40.77,8.13) ; v7(18.67,5.72) 18.67,7.1 U1.50
  Bottom Layer w0.254: U10.9 44.4,11.76 v7(40.77,8.13) ; v7(18.67,5.72) 18.67,6.07 19.53,6.93 33.86,6.93 v7(35.05,8.13)
SPK_EN: length 13.8
  Top Layer w0.203: U1.35 v1(14.86,15.62) 14.86,15.62
  Bottom Layer w0.203: v1(14.86,15.62) 16.51,15.62 16.76,15.37 16.76,10.41 16.38,10.03 11.48,10.03 11.43,10.09
ST25_ANT: length 1000
  Top Layer w0.254: v1(16.59,42.08) 16.59,37
  Bottom Layer w0.254: 16.59,37 arc(17.95,36.14) 18.37,34.58 ; 19.63,34.58 arc(20.1,36.21) 21.6,37 ; v1(16.59,42.08) 5.54,42.08 5.54,54.46 33.46,54.46 33.46,41.57 5.03,41.57 5.03,54.96 5.04,54.97 33.97,54.97 33.97,41.06 4.53,41.06 4.53,55.47 34.47,55.47 34.47,40.56 4.02,40.56 4.02,55.98 34.98,55.98 34.98,40.05 3.52,40.05 3.52,56.48 35.48,56.48 35.48,39.54 3.02,39.54 3.02,56.98 35.98,56.98 35.98,39.03 2.51,39.03 2.51,57.49 36.49,57.49 36.49,38.52 2.01,38.52 2.01,57.99 36.99,57.99 36.99,38.02 1.5,38.02 1.5,58.5 37.5,58.5 37.5,37.51 1,37.51 1,59 38,59 38,37 21.59,37
  vias: v1(16.59,37)
ST25_GPO: length 27.4
  Top Layer w0.203: v1(23.25,15.41) 23.25,12.6 26.23,9.62 U1.2 ; v1(19.05,20.07) 19.05,21.49 20.12,22.56 v1(20.12,23.5)
  Bottom Layer w0.203: U3.7 18.37,28.73 R3.1 17.45,26.16 v1(20.12,23.5) ; v1(19.05,20.07) 19.05,17.65 21.29,15.41 v1(23.25,15.41)
ST25_I2C_SCL: length 11.7
  Top Layer w0.203: v1(20.6,22.96) 20.6,22.45 19.69,21.55 U1.29
  Bottom Layer w0.203: U3.6 19.74,29.45 R4.1 20.6,26.95 v1(20.6,22.96)
ST25_I2C_SDA: length 23
  Top Layer w0.203: v1(21.2,17.02) 21.2,7.13 U1.55 ; v1(20.73,20.65) 21.21,21.13 v1(21.21,24.26)
  Bottom Layer w0.203: v1(21.2,17.02) 21.2,20.18 v1(20.73,20.65) ; v1(21.21,24.26) 21.21,27.63 R5.1 21.03,29.42 U3.5
ST25_VEH: length 28.4
  Top Layer w0.508: U11.2 4.93,18.04 v10(4.93,22.43)
  Bottom Layer w0.508: U3.1 16.75,34.1 C8.2 5.27,34.1 4.83,33.66 4.83,22.53 v10(4.93,22.43)
TX_HOLD: length 16.9
  Top Layer w0.203: v1(39.5,18.67) 39.5,19.15 39.12,19.53 33.81,19.53 29.59,15.32 29.59,14.42 28.8,13.62 U1.10
  Bottom Layer w0.203: U16.5 v1(39.5,18.67)
USB_DETECT: length 24
  Top Layer w0.203: v1(12.7,14.12) 12.34,14.48 10.03,14.48 9.53,13.97 8.13,13.97 7.87,14.22 7.87,15.24 7.62,15.49 6.48,15.49 6.42,15.55 R24.2 ; 14.9,14.12 14.9,14.12 U1.38 17.41,14.12 17.51,14.22
  Top Layer w0.254: U11.1 4.93,16 3.68,16 3.43,15.75 3.43,12.83 3.62,12.64 U12.1
  Top Layer w0.508: R25.2 R24.2 5.06,16.13 U11.1
  Bottom Layer w0.203: 18.63,14.35 18.5,14.22 17.51,14.22 ; v1(12.7,14.12) 14.9,14.12
  vias: v1(14.86,14.12) v1(17.5,14.22)
USB_ENABLE: length 7.6
  Top Layer w0.203: U1.41 16.19,12.62 v1(14.56,12.62) ; R6.2 v1(12.24,16)
  Bottom Layer w0.203: v1(12.24,16) 11.96,15.72 11.96,14.09 13.43,12.62 v1(14.56,12.62)
USB_N: length 24.4
  Top Layer w0.203: 10.92,23.81 7.94,23.81 7.87,23.88 ; 10.92,23.81 11.67,23.81 11.68,23.82 U4.16 ; 10.92,23.81 v1(10.92,24.51) ; v1(14.86,11.1) 16.17,11.1 U1.44 ; USB1.B7 7.87,24.88 8.13,24.62 8.13,24.14 7.87,23.88 ; 7.87,23.88 USB1.A7
  Bottom Layer w0.203: v1(10.92,24.51) 10.92,13.77 13.59,11.1 v1(14.86,11.1)
USB_P: length 28.8
  Top Layer w0.203: U4.17 11.68,23.44 11.67,23.45 10.41,23.45 ; USB1.A6 6.3,24.38 6.1,24.18 6.1,23.57 6.3,23.37 7.1,23.37 USB1.B6 7.87,23.38 7.94,23.45 10.41,23.45 ; 10.41,23.45 v1(10.41,22.86) ; v1(11.78,11.95) 12.24,12.41 R7.1 ; U1.45 16.18,10.61 14.59,10.61
  Top Layer w0.254: R11.2 10.41,21.2 v1(10.41,22.86)
  Bottom Layer w0.203: v1(11.78,11.95) 12.04,12.21 ; 12.04,12.21 13.65,10.61 14.59,10.61 ; 12.04,12.21 10.41,13.84 10.41,18.46 arc(10.38,18.56) 10.28,18.6 arc(10.19,18.64) 10.15,18.73 10.15,18.82 arc(10.19,18.91) 10.28,18.95 arc(10.37,18.99) 10.41,19.09 arc(10.36,19.21) 10.24,19.26 9.96,19.26 arc(9.78,19.44) 9.96,19.62 10.24,19.62 arc(10.36,19.67) 10.41,19.8 v1(10.41,22.86)
  vias: v1(14.56,10.61)
V_CHARGE: length 30.8
  Top Layer w0.381: R13.2 3.1,30.35 3.73,30.35
  Top Layer w0.508: v11(1.02,17.02) U11.3 2.67,17.16 2.67,18.03 3.73,19.1 3.73,30.35 U7.8 6.1,30.35 6.35,30.61 6.35,33.91 6.86,34.42 10.16,34.42 10.41,34.16 U7.4 12.41,34.16 C17.2
  Bottom Layer w0.508: D1.1 2.5,17.02 v11(1.02,17.02)
WIFI_EN: length 20.5
  Top Layer w0.203: U1.15 28.96,16.12 33.28,20.45 42.54,20.45 44,19 v1(44,18.67)
  Bottom Layer w0.203: U16.2 v1(44,18.67)
WIFI_UART_RX: length 27.4
  Top Layer w0.203: U1.16 27.69,18.37 30.15,20.83 35.2,20.83 35.91,21.54 35.91,31.62 v1(36.04,31.75) ; v1(34.8,31.75) 34.8,30.09
  Bottom Layer w0.203: v1(36.04,31.75) v1(34.8,31.75) 34.8,34.46 U16.11
WIFI_UART_TX: length 27.5
  Top Layer w0.203: v1(35.56,32.26) 35.56,21.69 35.05,21.18 30,21.18 27.44,18.62 U1.17 ; v1(36.7,32.26) 36.7,30.09
  Bottom Layer w0.203: v1(35.56,32.26) v1(36.7,32.26) 36.7,34.45 U16.12
WM8960_HP_ADC: length 23.2
  Top Layer w0.254: U15.7 10.03,2.03 v1(13.59,5.59) ; U1.9 27.65,13.08 v1(25.91,13.08)
  Bottom Layer w0.254: v1(25.91,13.08) 25.16,13.08 23.71,11.63 23.71,10.5 21.59,8.38 16.38,8.38 v1(13.59,5.59)
WM8960_I2C_SCL: length 6.2
  Top Layer w0.254: U1.61 24.19,7.12 v7(24.19,3.19)
  Bottom Layer w0.254: U15.2 23.03,2.03 v7(24.19,3.19)
WM8960_I2C_SDA: length 6.1
  Top Layer w0.254: U15.1 24.38,2.03 23.19,3.22 U1.59
WM8960_I2S_BCLK: length 17.8
  Top Layer w0.203: U15.5 15.11,2.36 15.11,6.17 13.49,7.79 13.49,15.98 v1(13.34,16.13) ; v1(14.35,16.13) 16.19,16.13 U1.34
  Bottom Layer w0.203: v1(14.35,16.13) v1(13.34,16.13)
WM8960_I2S_DAT: length 17.4
  Top Layer w0.203: U1.36 14.36,15.12 14.1,14.86 14.1,8.13 19.86,2.36 U15.3
WM8960_I2S_LRCLK: length 18.3
  Top Layer w0.203: U1.33 16.18,16.64 14.1,16.64 13.79,16.33 13.79,8 17.32,4.47 U15.4
WM8960_I2S_MCLK: length 17.5
  Top Layer w0.203: U1.37 16.18,14.61 14.6,14.61 ; U15.6 14.73,4.52 14.73,6.05 13.18,7.6 13.18,14.5 13.01,14.67
  Bottom Layer w0.203: v1(13.01,14.61) v1(14.56,14.61)
$1N193: length 6.8
  Bottom Layer w0.381: U17.1 9.84,8.32 9.4,8.76 6.42,8.76 L2.2
  Bottom Layer w0.508: D6.2 6.1,6.56 L2.2
$1N224: length 2.8
  Bottom Layer w0.508: U17.3 7.94,6.34 R32.2 R31.2
$1N908: length 4.5
  Bottom Layer w0.254: R29.1 11.38,9.27 8.38,9.27 7.94,9.71 U17.4
$1N11137: length 1.4
  Top Layer w0.508: R16.2 12.37,31.62 11.04,31.62
$1N11353: length 1.9
  Top Layer w0.381: 5.22,31.62 5.1,31.51 LED3.1
$1N11426: length 2
  Top Layer w0.381: U7.6 3.78,32.89 LED2.1
$1N11430: length 3.3
  Top Layer w0.381: LED2.2 LED3.2 1.85,31.44 R13.1
$1N17856: length 7.7
  Top Layer w0.508: C27.2 47.09,6.54 C26.2 45.95,6.56 U14.1 44.45,6.5 44.45,5.97 44.07,5.59 43.05,5.59 42.61,6.03 U14.3 42.68,6.63 U13.2
$1N17857: length 4.6
  Top Layer w0.508: U13.1 44.19,9.14 44.7,9.65 47.33,9.65 47.5,9.82
$1N20354: length 3
  Top Layer w0.203: TP1.1 16.1,20.22 16.1,22.12 16,22.23 U4.2
$1N20560: length 1.7
  Top Layer w0.203: USB1.B5 7.14,22.35 R8.1
$1N20561: length 1.7
  Top Layer w0.203: USB1.A5 7.13,25.4 R9.1
$1N24105: length 9
  Top Layer w0.254: v1(38.35,23.24) 38.33,23.22 U18.2
  Bottom Layer w0.254: U16.8 35.05,17.21 35.05,18.16 38.35,21.46 v1(38.35,23.24)
$1N24200: length 3.3
  Top Layer w0.203: v1(36.49,18.61) 36.5,18.6 R30.1
  Bottom Layer w0.203: v1(36.49,18.61) 36.49,17.17 U16.7
$1N24263: length 2.4
  Top Layer w0.254: R28.1 42.48,33.13 v1(42.5,33.15)
  Bottom Layer w0.254: U16.16 v1(42.5,33.15)
$1N25076: length 8.8
  Top Layer w0.381: D3.2 26.8,30.61 27.05,30.35 30.73,30.35 31.12,30.73 ; 31.12,30.73 D4.1 ; 31.12,30.73 v1(31.12,29.34)
  Bottom Layer w0.381: v1(31.12,29.34) 30.61,28.83 C22.1
$1N25092: length 12.5
  Top Layer w0.381: v1(27.94,31.62) 28.91,31.62 D5.2 ; Q3.2 23.44,27.69 v1(24.26,27.69)
  Bottom Layer w0.381: 27.94,29.21 v1(27.94,31.62) 28.57,32.26 L1.2 ; 27.94,29.21 27.94,28.32 27.43,27.81 24.38,27.81 v1(24.26,27.69) ; 27.94,29.21 28.32,28.83 C22.2
$1N25624: length 2.6
  Top Layer w0.203: U8.21 21.75,24.73 21.97,24.51 v1(22.1,24.51)
  Bottom Layer w0.203: v1(22.1,24.51) C15.2
$1N25630: length 3
  Top Layer w0.203: U8.20 22.25,25.12 22.86,24.51 v1(23.24,24.51)
  Bottom Layer w0.203: C16.2 23.24,23.79 v1(23.24,24.51)
$1N25688: length 3.1
  Top Layer w0.203: U8.7 28.7,25.95 28.7,25.02 28.19,24.51 v1(27.69,24.51)
  Bottom Layer w0.203: C23.2 v1(27.69,24.51)
$1N25691: length 2
  Top Layer w0.203: v1(28.96,27.15) 29.25,26.85 U8.6
  Bottom Layer w0.203: v1(28.96,27.15) C24.2
$1N25694: length 2.8
  Top Layer w0.203: v1(28.96,24.51) 29.21,24.51 29.72,25.02 29.72,25.97 U8.5
  Bottom Layer w0.203: C25.2 v1(28.96,24.51)
$1N25702: length 2.6
  Top Layer w0.203: U8.3 30.73,25.98 30.73,25.02 v1(30.23,24.51)
  Bottom Layer w0.203: C31.2 v1(30.23,24.51)
$1N25710: length 2.4
  Top Layer w0.203: U8.1 31.75,24.77 v1(31.5,24.51)
  Bottom Layer w0.203: C33.2 v1(31.5,24.51)
$1N27235: length 3.8
  Top Layer w0.203: v1(23.24,8.51) 23.69,8.06 U1.60
  Bottom Layer w0.203: v1(23.24,8.51) 23.24,9.35 R1.1
$1N38507: length 2.8
  Top Layer w0.254: Q1.1 8.84,14.86 9.78,14.86 10.16,15.24 R6.1
$1N38509: length 1.5
  Top Layer w0.254: R7.2 11.17,12.91 11.17,13.59 10.92,13.84 Q1.3
$1N62037: length 8
  Top Layer w0.508: R10.1 50.03,62.93 Q2.1 49.22,62.86 v2(43.51,62.86)
  Bottom Layer w0.508: R34.2 v2(43.51,62.86)
$1N62044: length 6.5
  Top Layer w0.508: 49.16,64.83 49.16,65.27 v12(48.77,65.66)
  Bottom Layer w0.508: v12(48.77,65.66) 48.39,65.66 U6.3 45.59,63.63 R34.1
$1N62069: length 2.9
  Top Layer w0.508: v12(50.8,65.15) 50.8,64.57 R10.2
  Bottom Layer w0.508: v12(50.8,65.15) 50.77,65.12 U6.1
$1N70319: length 2.3
  Top Layer w0.508: LED1.2 45.57,63.88 Q2.3
$1N72407: length 1.1
  Top Layer w0.508: v2(42.67,64.52) LED1.1
  Bottom Layer w0.508: v2(42.67,64.52) 42.68,64.52 R33.1
$1N74846: length 6.5
  Top Layer w0.381: Q4.3 10.41,27.69 10.67,27.94 v2(10.67,28.73)
  Bottom Layer w0.381: U19.2 10.54,26.54 10.67,26.67 v2(10.67,28.73) BUZZER1.2
$1N74877: length 3.2
  Bottom Layer w0.381: BUZZER1.1 13.98,26.97 C38.1 13.93,26.92 13.59,26.92 13.21,26.54 U19.1
$1N74960: length 3.3
  Top Layer w0.508: Q4.1 13.48,26.74 R35.2 R36.2

## Copper pours and planes (outline as drawn; the poured copper is in the pictures)
GND on Top Layer: -4.7,61.09 53.72,61.09 53.72,-2.79 -4.7,-2.79
GND on Bottom Layer: -2.92,60.96 53.72,60.96 53.72,-2.79 -2.92,-2.79
GND on Bottom Layer: 37.85,28.32 40.77,28.32 40.77,25.4 37.85,25.4
GND on Inner2: -1.17,61.09 53.72,61.09 53.72,-2.79 -1.17,-2.79
LED_VCC on Inner1: 40.39,67.56 52.83,67.56 52.83,61.09 40.39,61.09
$1N62044 on Inner2: 39.85,67.56 52.32,67.56 52.32,61.09 39.85,61.09

Small or netless copper shapes (teardrops, artwork), in the pictures only: 344 on Top Layer, 260 on Bottom Layer, 17 on Inner1

## Text on the board
Bottom Silkscreen Layer: - | +
Top Silkscreen Layer: DAP10K | 0 | NFC
